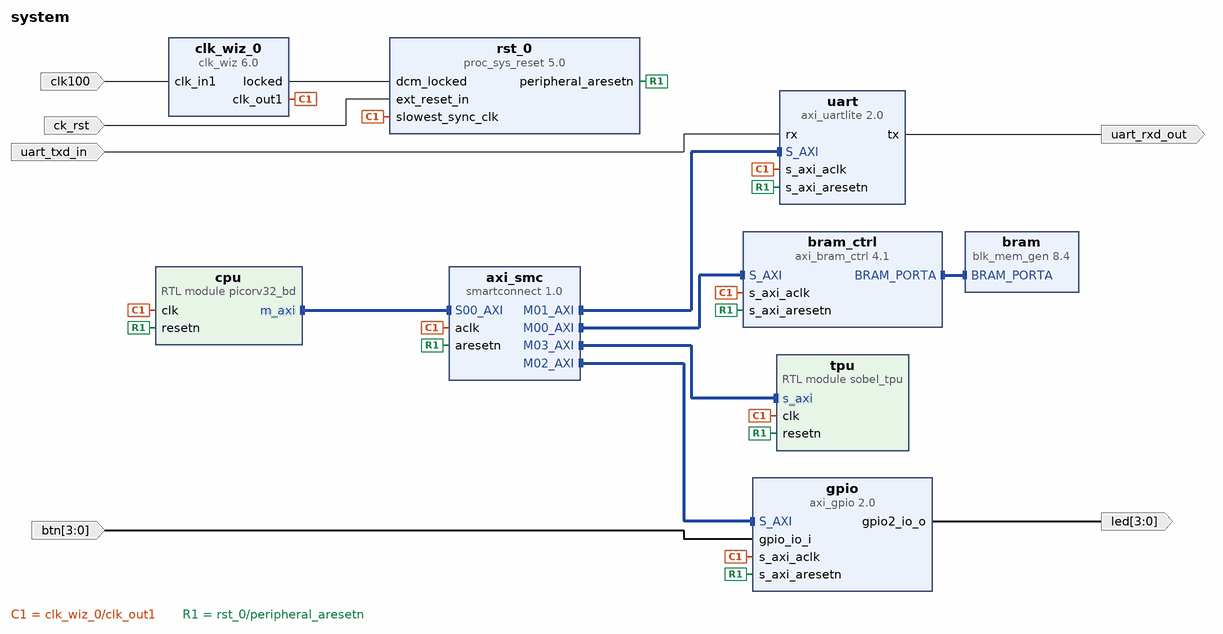
[diagram p0: block diagram of the top level]
# Vivado block design system, xc7a100tcsg324-1, Vivado 2023.2
create_bd_design system

create_bd_port -dir I -type clk clk100
set_property -dict {CONFIG.FREQ_HZ 100000000} [get_bd_ports clk100]
create_bd_port -dir I -type rst ck_rst
set_property -dict {CONFIG.POLARITY ACTIVE_LOW} [get_bd_ports ck_rst]
create_bd_port -dir I uart_txd_in
create_bd_port -dir O uart_rxd_out
create_bd_port -dir I -from 3 -to 0 btn
create_bd_port -dir O -from 3 -to 0 led

create_bd_cell -type ip -vlnv xilinx.com:ip:clk_wiz:6.0 clk_wiz_0
set_property -dict [list \
  CONFIG.CLKOUT1_REQUESTED_OUT_FREQ 100.000 \
  CONFIG.PRIM_IN_FREQ 100.000 \
  CONFIG.USE_LOCKED true \
  CONFIG.USE_RESET false \
] [get_bd_cells clk_wiz_0]
create_bd_cell -type ip -vlnv xilinx.com:ip:proc_sys_reset:5.0 rst_0
create_bd_cell -type module -reference picorv32_bd cpu
create_bd_cell -type module -reference sobel_tpu tpu
create_bd_cell -type ip -vlnv xilinx.com:ip:smartconnect:1.0 axi_smc
set_property -dict {CONFIG.NUM_MI 4 CONFIG.NUM_SI 1} [get_bd_cells axi_smc]
create_bd_cell -type ip -vlnv xilinx.com:ip:axi_bram_ctrl:4.1 bram_ctrl
set_property -dict {CONFIG.DATA_WIDTH 32 CONFIG.SINGLE_PORT_BRAM 1} [get_bd_cells bram_ctrl]
create_bd_cell -type ip -vlnv xilinx.com:ip:blk_mem_gen:8.4 bram
set_property -dict {CONFIG.use_bram_block BRAM_Controller} [get_bd_cells bram]
create_bd_cell -type ip -vlnv xilinx.com:ip:axi_uartlite:2.0 uart
set_property -dict {CONFIG.C_BAUDRATE 230400 CONFIG.C_DATA_BITS 8} [get_bd_cells uart]
create_bd_cell -type ip -vlnv xilinx.com:ip:axi_gpio:2.0 gpio
set_property -dict [list \
  CONFIG.C_ALL_INPUTS 1 \
  CONFIG.C_ALL_OUTPUTS_2 1 \
  CONFIG.C_GPIO2_WIDTH 4 \
  CONFIG.C_GPIO_WIDTH 4 \
  CONFIG.C_IS_DUAL 1 \
] [get_bd_cells gpio]

# ---- connections ----

connect_bd_intf_net [get_bd_intf_pins axi_smc/M00_AXI] [get_bd_intf_pins bram_ctrl/S_AXI]
connect_bd_intf_net [get_bd_intf_pins axi_smc/M01_AXI] [get_bd_intf_pins uart/S_AXI]
connect_bd_intf_net [get_bd_intf_pins axi_smc/M02_AXI] [get_bd_intf_pins gpio/S_AXI]
connect_bd_intf_net [get_bd_intf_pins axi_smc/M03_AXI] [get_bd_intf_pins tpu/s_axi]
connect_bd_intf_net [get_bd_intf_pins bram_ctrl/BRAM_PORTA] [get_bd_intf_pins bram/BRAM_PORTA]
connect_bd_intf_net [get_bd_intf_pins cpu/m_axi] [get_bd_intf_pins axi_smc/S00_AXI]
connect_bd_net [get_bd_ports btn] [get_bd_pins gpio/gpio_io_i]
connect_bd_net [get_bd_ports ck_rst] [get_bd_pins rst_0/ext_reset_in]
connect_bd_net -net clk100_1 [get_bd_ports clk100] [get_bd_pins clk_wiz_0/clk_in1]
connect_bd_net [get_bd_pins clk_wiz_0/clk_out1] \
  [get_bd_pins cpu/clk] [get_bd_pins tpu/clk] [get_bd_pins axi_smc/aclk] [get_bd_pins bram_ctrl/s_axi_aclk] \
  [get_bd_pins uart/s_axi_aclk] [get_bd_pins gpio/s_axi_aclk] [get_bd_pins rst_0/slowest_sync_clk]
connect_bd_net [get_bd_pins clk_wiz_0/locked] [get_bd_pins rst_0/dcm_locked]
connect_bd_net [get_bd_pins gpio/gpio2_io_o] [get_bd_ports led]
connect_bd_net [get_bd_pins rst_0/peripheral_aresetn] \
  [get_bd_pins cpu/resetn] [get_bd_pins tpu/resetn] [get_bd_pins axi_smc/aresetn] [get_bd_pins bram_ctrl/s_axi_aresetn] \
  [get_bd_pins uart/s_axi_aresetn] [get_bd_pins gpio/s_axi_aresetn]
connect_bd_net [get_bd_pins uart/tx] [get_bd_ports uart_rxd_out]
connect_bd_net [get_bd_ports uart_txd_in] [get_bd_pins uart/rx]

# ---- address map ----
assign_bd_address -offset 0x00000000 -range 256K -target_address_space [get_bd_addr_spaces cpu/m_axi] [get_bd_addr_segs bram_ctrl/S_AXI/Mem0]
assign_bd_address -offset 0x40000000 -range 64K -target_address_space [get_bd_addr_spaces cpu/m_axi] [get_bd_addr_segs gpio/S_AXI/Reg]
assign_bd_address -offset 0x40600000 -range 64K -target_address_space [get_bd_addr_spaces cpu/m_axi] [get_bd_addr_segs uart/S_AXI/Reg]
assign_bd_address -offset 0x44000000 -range 256K -target_address_space [get_bd_addr_spaces cpu/m_axi] [get_bd_addr_segs tpu/s_axi/reg0]

validate_bd_design
save_bd_design
